# Altium project AEON.Feeder.ApplicationBoard.PrjPcb
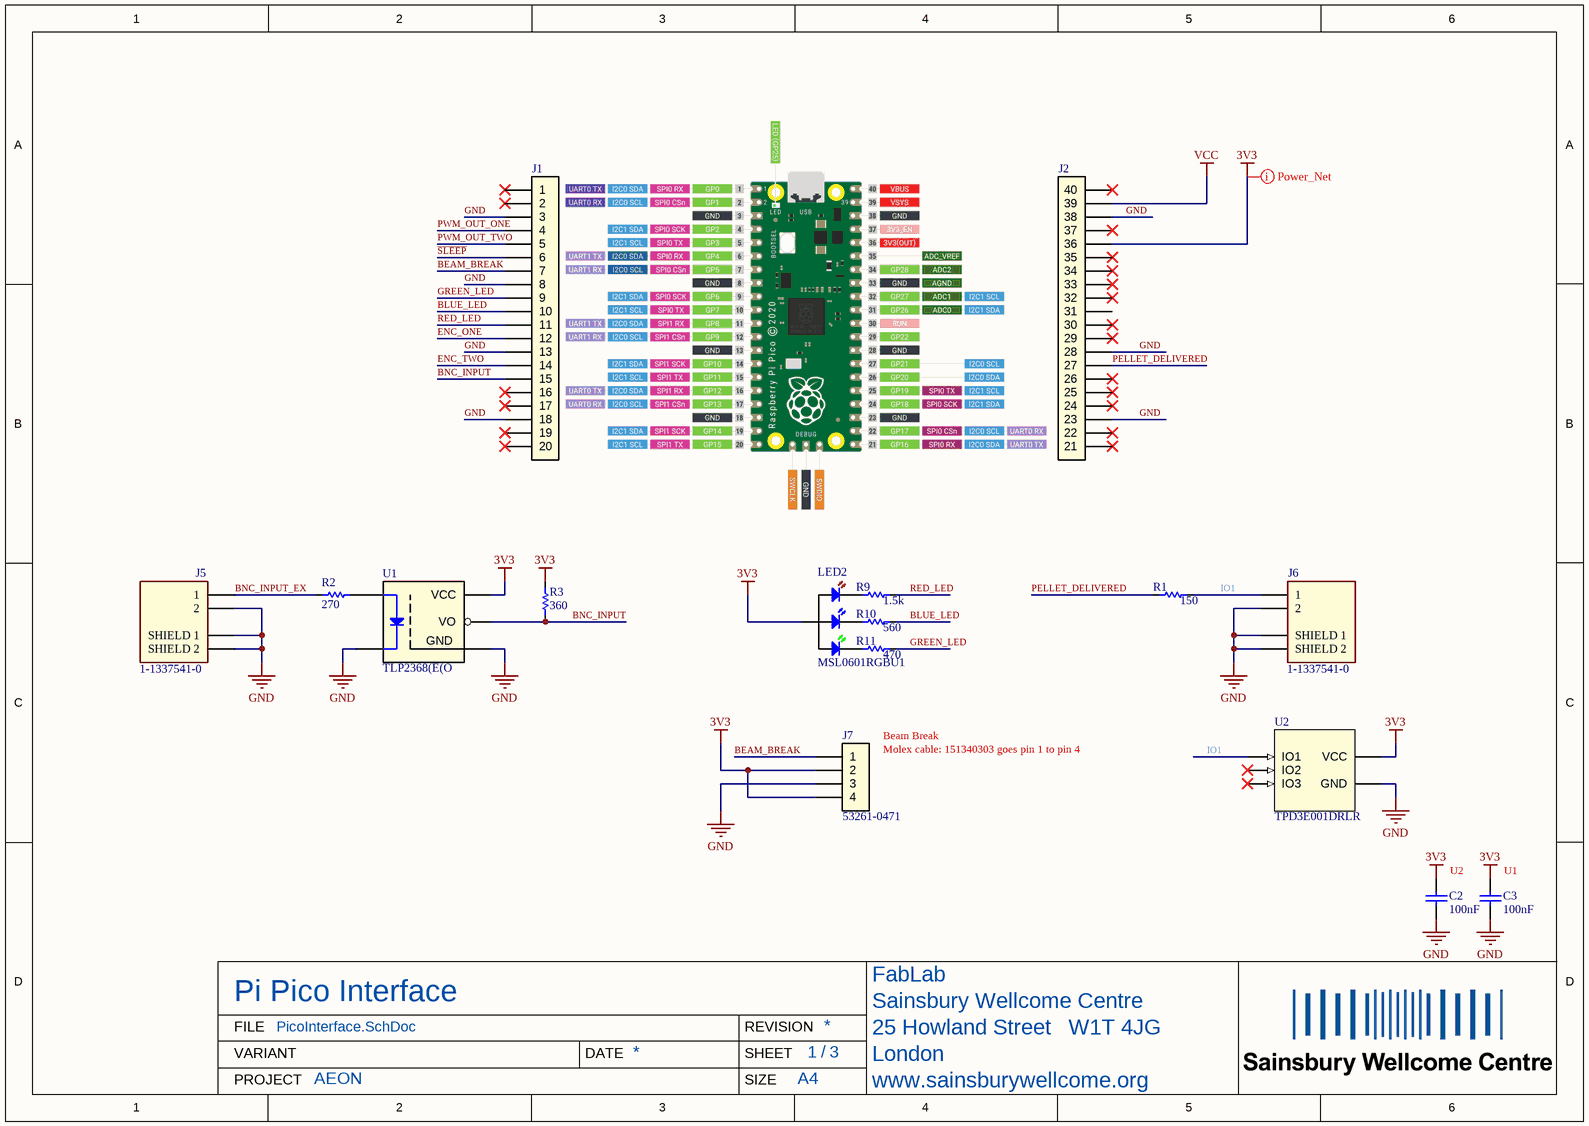
[diagram p0: PicoInterface.SchDoc]
Project: AEON
3 sheets, 33 parts. Net scope: global (net labels, ports and power ports of the same name join across sheets).
Board file: AEON.Feeder.ApplicationBoard.PcbDoc
Sheets:
  PicoInterface.SchDoc
  PowerSupply.SchDoc
  MotorDriver.Mikroe.SchDoc

## Sheet PicoInterface.SchDoc
size 297 x 209 mm; SheetNumber: 1; SheetTotal: 3; swcgroup: FabLab; Org: Sainsbury Wellcome Centre; Add1: 25 Howland Street; Add2: London; Add3: W1T 4JG; WebAddress: www.sainsburywellcome.org; SheetSize: A4; SheetName: Pi Pico Interface

### Parts
C2  value 100nF  [FP-GRM188-0_1-e0_2_0_5-IPC_B]  (hidden comment: C0603-100nF-100V-10%-X7R)
C3  value 100nF  [FP-GRM188-0_1-e0_2_0_5-IPC_B]  (hidden comment: C0603-100nF-100V-10%-X7R)
J1  SSW-120-01-x-S  [SAMTEC_SSW-120-01-G-S]  (value not drawn)
J2  SSW-120-01-x-S - 21-40  [SAMTEC_SSW-120-01-G-S - 21-40]  (value not drawn)
J5  1-1337541-0  [TE- 1-1337541-0]
J6  1-1337541-0  [TE- 1-1337541-0]
J7  53261-0471  [MOLEX_53261-0471]
LED2  MSL0601RGBU1  [LED_MSL06_ROM]
R1  value 150  [FP-CPF0603-IPC_B]  (hidden comment: R0603-150R-1/16W-0.1%)
R2  value 270  [FP-CPF0603-IPC_B]  (hidden comment: R0603-270R-1/16W-0.1%)
R3  value 360  [FP-CPF0603-IPC_B]  (hidden comment: R0603-360R-1/16W-0.1%)
R9  value 1.5k  [FP-CPF0603-IPC_B]  (hidden comment: R0603-1k5-1/16W-0.1%)
R10  value 560  [FP-CPF0603-IPC_B]  (hidden comment: R0603-560R-1/16W-0.1%)
R11  value 470  [FP-CPF0603-IPC_B]  (hidden comment: R0603-470R-1/16W-0.1%)
U1  PartNumber: TLP2368(E(O  [5pin SO6_TOS]  (hidden comment: TLP2368)
U2  TPD3E001DRLR  [DRL5_TEX]

### Nets
3V3: C2.2 C3.2 J2.36 J7.2 J7.4 LED2.1 R3.2 U1.6(VCC) U2.5(VCC)
GND: C2.1 C3.1 J1.3 J1.8 J1.13 J1.18 J2.23 J2.28 J2.38 J5.2 J5.SH1(SHIELD_1) J5.SH2(SHIELD_2) J6.2 J6.SH1(SHIELD_1) J6.SH2(SHIELD_2) J7.3 U1.3(CATHODE) U1.4(GND) U2.3(GND)
VCC: J2.39
~{SLEEP}: J1.6
BEAM_BREAK: J1.7 J7.1
BLUE_LED: J1.10 R10.2
BNC_INPUT: J1.15 R3.1 U1.5(VO)
BNC_INPUT_EX: J5.1 R2.1
ENC_ONE: J1.12
ENC_TWO: J1.14
GREEN_LED: J1.9 R11.2
IO1: J6.1 R1.2 U2.1(IO1)
PELLET_DELIVERED: J2.27 R1.1
PWM_OUT_ONE: J1.4
PWM_OUT_TWO: J1.5
RED_LED: J1.11 R9.2
NetLED2_2: LED2.2 R11.1
NetLED2_3: LED2.3 R10.1
NetLED2_4: LED2.4 R9.1
NetR2_2: R2.2 U1.1(ANODE)

Not connected (* = marked no-connect by the designer): J1 1* 2* 16* 17* 19* 20*; J2 21* 22* 24* 25* 26* 29* 30* 31 32* 33* 34* 35* 37* 40*; U2 2(IO2)* 4(IO3)*

### Layout directives
net class Power Nets: 3V3

### Notes on the sheet
- (near J7) Beam Break
- (near J7) Molex cable: 151340303 goes pin 1 to pin 4
- U2
- (near C3) U1
- FILE
- VARIANT
- DATE
- REVISION
- SHEET
- /
- PROJECT
- SIZE

### Library data of the parts
C2 C3 = CMP-611-0027-15: 0.1µF ±10% 100V Ceramic Capacitor X7R 0603 (1608 Metric); Pick&PlaceFootprint: 0603_CAP; Dielectric: X7R; REACH SVHC: No SVHC; Case Code (Metric): 1608; Series: GRM; Case/Package: 0603; Capacitance: 100nF; RoHS Compliant: Yes; Radiation Hardening: No; Case Code (Imperial): 0603; Min Operating Temperature: -55°C; Capacitor Type: Ceramic; Voltage Rating: 100V; Construction: Flat; Lead Free: Lead Free; Size: 0.8mm; Packaging: Tape and Reel; Voltage Rating (DC): 100V; Voltage: 100V; Width: 0.8mm; Max Operating Temperature: 125°C; RoHS: Yes; Material: Ceramic; Depth: 0.8mm; Thickness: 0.035inch; Termination: SMD/SMT; Weight: 0.000222oz; Length: 1.6mm; Mount: Surface Mount; Height: 0.8mm; Package Quantity: 1; Tolerance: 10%
J1 = CMP-310-0034-2: Conn Socket Strip SKT 20 POS 2.54mm Solder ST Thru-Hole; Gender: Female; Number of Contacts: 20; Mating Cycles: 100; Number of Rows: 1; Color: Black; RoHS Compliant: Yes; Contact Plating: Gold; Pitch: 2.54mm; Termination: Solder; Contact Material: Bronze; Mount: Through Hole
J2 = CMP-310-0035-1: Conn Socket Strip SKT 20 POS 2.54mm Solder ST Thru-Hole (pins 21 - 40); Gender: Female; Mating Cycles: 100; Number of Contacts: 20; Contact Material: Bronze; RoHS Compliant: Yes; Number of Rows: 1; Contact Plating: Gold; Mount: Through Hole; Pitch: 2.54mm; Termination: Solder; Color: Black
J5 J6 = CMP-730-0000-5: TE CONNECTIVITY / GREENPAR         1-1337541-0            RF / Coaxial Connector, BNC Coaxial, Straight Jack, Solder, 50 ohm, Brass; PCB Mounting Orientation: Vertical; Body Plating: Nickel; Number of Positions: 1; Connector Type: BNC, Jack; Sealable: No (Without); Polarity: Normal; PCB Mount Retention: With; Insulation Resistance: 5GR; Max Frequency: 4GHz; Tail Length: 5.8mm; Gender: Female; PCB Thickness: 0.126inch; Body Material: Zinc; Dielectric Material: PE; Impedance: 50R; Max Operating Temperature: 85°C; Length: 14.76mm; Min Operating Temperature: -55°C; Radiation Hardening: No; Insulation Material: Polybutylene; Mount: Panel; Fastening Type: Bayonet; Packaging: Box; Housing Material: Polyester; Housing Colour: White; Contact Material: Brass; Frequency: 4GHz; ELV: Compliant; Colour: White; Plating: Nickel; PartNumber: 1-1337541-0; Contact Plating: Gold; REACH SVHC: Unknown; Termination: Solder; Orientation: Straight; Package Quantity: 100; Depth: 15.8mm
J7 = CMP-370-0017-6: MOLEX 1.25mm (.049") Pitch PicoBlade Header, Surface Mount, Right Angle, Lead-free, 4 Circuits; Gender: Male; Voltage Rating: 125V; Number of Positions: 4; Contact Resistance: 20mR; Insulation Resistance: 100MR; Current Rating: 1A; Glow Wire Compliant: Non-compliant; Orientation: Right Angle; Package Quantity: 1000; Color: Beige; Voltage Rating (DC): 125V; Series: 53261; Lead Free: Lead Free; Contact Plating: Tin; Housing Color: Natural; Contact Gender: Male; Contact Material: Tin; Number of Rows: 1; Mount: Surface Mount; Housing Material: Thermoplastic; Lead Pitch: 1.25mm; Working Voltage: 125V; Flammability Rating: UL94 V-0; Packaging: Cut Tape; Termination: SMD/SMT; Pitch: 1.25mm; Radiation Hardening: No; Min Operating Temperature: -40°C; Case/Package: 53261-0471; Voltage Rating (AC): 125V; Number of Circuits: 4; Contact Type: -; Max Operating Temperature: 105°C; Number of Contacts: 4; REACH SVHC: Unknown; Weight: 0.005598oz
LED2 = CMP-520-0010-2: Triple Color LED, Red/green/blue, Milky White; Pick&PlaceFootprint: MSL06; Mount: Surface Mount; PartNumber: MSL0601RGBU1
R1 = CMP-633-0078-2: Surface Mount Resistor 150 Ohm 1/16 W 0.1% 0603 (1608 Metric); Number of Resistors: 1; Pick&PlaceFootprint: R0603; Temperature Coefficient: 25ppm/°C; Power Rating: 62.5mW; Voltage Rating: 50V; Max Power Dissipation: 62.5 mW; Max Operating Temperature: 155°C; Series: CPF; RoHS: Yes; Case Code (Metric): 1608; Width: 0.8mm; Construction: Chip; Length: 1.6mm; Composition: Thin Film; Min Operating Temperature: -55°C; REACH SVHC: Yes; RoHS Compliant: Yes; Height: 0.45mm; Termination: Wraparound; Packaging: Tape and Reel; Resistance: 150; Size Code: 0603; Technology: THIN FILM; ELV: Compliant; Weight: 7.1E-05oz; Tolerance: 0.1%; Number of Pins: 2; Resistance Tolerance: 0.1%; Resistor Type: FIXED RESISTOR; Mount: Surface Mount; Number of Terminations: 2; Case Code (Imperial): 0603; Voltage Rating (DC): 50V; Case/Package: 0603
R2 = CMP-633-0083-1: Surface Mount Resistor 270 Ohm 1/16 W 0.1% 0603 (1608 Metric); Voltage Rating: 50V; Number of Resistors: 1; Max Power Dissipation: 62.5 mW; Pick&PlaceFootprint: R0603; Power Rating: 62.5mW; Temperature Coefficient: 25ppm/°C; Voltage Rating (DC): 50V; Weight: 7.1E-05oz; RoHS: Yes; REACH SVHC: Yes; Size Code: 0603; Mount: Surface Mount; Tolerance: 0.1%; Composition: Thin Film; Length: 1.6mm; Number of Pins: 2; Min Operating Temperature: -55°C; Width: 0.8mm; Technology: THIN FILM; Max Operating Temperature: 155°C; Resistor Type: FIXED RESISTOR; Number of Terminations: 2; Case Code (Imperial): 0603; Packaging: Tape and Reel; Construction: Chip; Case Code (Metric): 1608; Case/Package: 0603; Series: CPF; RoHS Compliant: Yes; Termination: Wraparound; Resistance: 270; ELV: Compliant; Height: 0.45mm; Resistance Tolerance: 0.1%
R3 = CMP-633-0019-16: Surface Mount Resistor 360 Ohm 1/16 W 0.1% 0603 (1608 Metric); Pick&PlaceFootprint: R0603; Voltage Rating: 50V; Number of Resistors: 1; Temperature Coefficient: 25ppm/°C; Power Rating: 62.5mW; Max Power Dissipation: 62.5 mW; REACH SVHC: No SVHC; Tolerance: 0.1%; Case Code (Metric): 1608; Weight: 7.1E-05oz; Resistance Tolerance: 0.1%; Resistor Type: Thin Film; Series: CPF; RoHS: Yes; Case/Package: 0603; Voltage Rating (DC): 50V; Length: 1.6mm; Max Operating Temperature: 155°C; Technology: Thin Film; Min Operating Temperature: -55°C; Packaging: Tape and Reel; Size Code: 0603; ELV: Compliant; Number of Terminations: 2; Resistance: 360; Height: 0.45mm; Case Code (Imperial): 0603; Number of Pins: 2; Composition: Thin Film; Mount: Surface Mount; RoHS Compliant: Yes; Termination: Solder; Width: 0.8mm
R9 = CMP-633-0029-14: Surface Mount Resistor 1k5 Ohm 1/16 W 0.1% 0603 (1608 Metric); Number of Resistors: 1; Power Rating: 62.5mW; Max Power Dissipation: 62.5 mW; Voltage Rating: 50V; Pick&PlaceFootprint: R0603; Temperature Coefficient: 25ppm/°C; Length: 1.6mm; Resistance: 1.5k; Case Code (Metric): 1608; Max Operating Temperature: 155°C; Technology: Thin Film; Height: 0.45mm; Resistor Type: Thin Film; Case Code (Imperial): 0603; Case/Package: 0603; Number of Terminations: 2; Min Operating Temperature: -55°C; REACH SVHC: No SVHC; Width: 0.8mm; RoHS Compliant: Yes; ELV: Compliant; Size Code: 0603; RoHS: Yes; Packaging: Tape and Reel; Tolerance: 0.1%; Mount: Surface Mount; Composition: Thin Film; Voltage Rating (DC): 50V; Weight: 7.1E-05oz; Termination: Solder; Number of Pins: 2; Resistance Tolerance: 0.1%; Series: CPF
R10 = CMP-633-0030-9: Surface Mount Resistor 560 Ohm 1/16 W 0.1% 0603 (1608 Metric); Number of Resistors: 1; Voltage Rating (DC): 50V; Temperature Coefficient: 25ppm/°C; Pick&PlaceFootprint: R0603; Power Rating: 62.5mW; Max Power Dissipation: 62.5 mW; ELV: Compliant; Technology: Thin Film; Resistor Type: Thin Film; Series: CPF; Number of Terminations: 2; Case Code (Metric): 1608; Resistance: 560; Case/Package: 0603; Width: 0.8mm; Max Operating Temperature: 155°C; Length: 1.6mm; RoHS Compliant: Yes; Termination: Solder; Voltage Rating: 50V; Min Operating Temperature: -55°C; Height: 0.45mm; Weight: 7.1E-05oz; Case Code (Imperial): 0603; Size Code: 0603; Mount: Surface Mount; REACH SVHC: No SVHC; RoHS: Yes; Composition: Thin Film; Packaging: Tape and Reel; Tolerance: 0.1%; Number of Pins: 2; Resistance Tolerance: 0.1%
R11 = CMP-633-0020-13: Surface Mount Resistor 470 Ohm 1/16 W 0.1% 0603 (1608 Metric); Power Rating: 62.5mW; Max Power Dissipation: 62.5 mW; Pick&PlaceFootprint: R0603; Temperature Coefficient: 25ppm/°C; Voltage Rating: 50V; Number of Resistors: 1; ELV: Compliant; Series: CPF; Mount: Surface Mount; Weight: 7.1E-05oz; Resistance Tolerance: 0.1%; Width: 0.8mm; REACH SVHC: No SVHC; Length: 1.6mm; Termination: Solder; Number of Pins: 2; Size Code: 0603; Case Code (Imperial): 0603; RoHS Compliant: Yes; Max Operating Temperature: 155°C; Packaging: Tape and Reel; Tolerance: 0.1%; Resistance: 470; Min Operating Temperature: -55°C; Resistor Type: Thin Film; Case Code (Metric): 1608; Number of Terminations: 2; Technology: Thin Film; Case/Package: 0603; Composition: Thin Film; Voltage Rating (DC): 50V; Height: 0.45mm; RoHS: Yes
U1 = CMP-530-0000-11: TOSHIBA         TLP2368(E(O             Digital Output Optocoupler, Open Collector, 1 Channel, SOIC, 5 Pins, 3.75 kV, 20 Mbaud; Forward Voltage: 1.7V; Reverse Breakdown Voltage: 5V; Output Current: 25mA; Direction: Unidirectional; Power Dissipation: 60mW; Pick&PlaceFootprint: SO6; Propagation Delay: 60ns; Number of Elements: 1; Input Current: 14mA; Isolation Voltage: 3.75kV; Packaging: Tape and Reel; Min Operating Temperature: -40°C; Mount: Surface Mount; Case/Package: SO; Max Operating Temperature: 125°C; Radiation Hardening: No; Forward Current: 25mA; Number of Channels: 1; Number of Pins: 5; REACH SVHC: No SVHC
U2 = CMP-820-0000-4: Low-Capacitance 3-Channel +/-15KV ESD-Protection Array for High-Speed Data Interfaces 5-SOT-5X3; Pick&PlaceFootprint: DRL-5; Mount: Surface Mount; PartNumber: TPD3E001DRLR

## Sheet PowerSupply.SchDoc
size 297 x 209 mm; SheetNumber: 2; SheetTotal: 3; swcgroup: FabLab; Org: Sainsbury Wellcome Centre; Add1: 25 Howland Street; Add2: London; Add3: W1T 4JG; WebAddress: www.sainsburywellcome.org; SheetSize: A4; SheetName: Power Supply
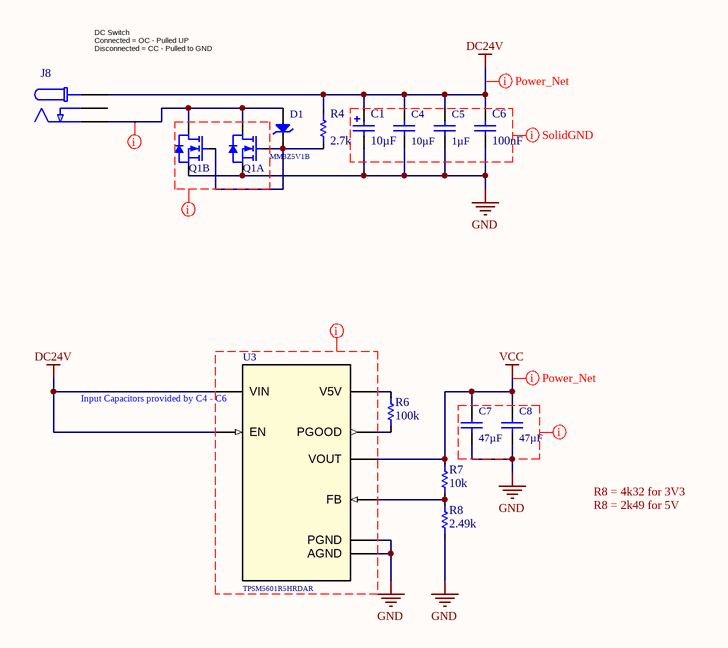
[diagram p1: PowerSupply.SchDoc]

### Parts
C1  value 10µF  [CAP_EEEFK1H100P]  (hidden comment: CPOLD-10uF-50V-20%-Alu)
C4  value 10µF  [CAPC3225X279X50NL20T25]  (hidden comment: C1210-10uF-50V-10%-X7R)
C5  value 1µF  [CAPC0805(2012)130_N]  (hidden comment: C0805-1uF-50V-10%-X7R)
C6  value 100nF  [FP-GRM188-0_1-e0_2_0_5-IPC_B]  (hidden comment: C0603-100nF-100V-10%-X7R)
C7  value 47µF  [FP-GRM32E-0_3-0_2-IPC_B]  (hidden comment: C1210-47uF-10V-10%-X7R)
C8  value 47µF  [FP-GRM32E-0_3-0_2-IPC_B]  (hidden comment: C1210-47uF-10V-10%-X7R)
D1  PartNumber: MM3Z5V1B  [SODFL250X100-2N]  (hidden comment: MM3Z10VB)
J8  694108105102  [WE_694108105102]  (value not drawn)
Q1  FDMC8030  [TRANS_FDMC8030]  (value not drawn)  (parts A,B of 2)
R4  value 2.7k  [FP-CPF0603-IPC_B]  (hidden comment: R0603-2k7-1/16W-0.1%)
R6  value 100k  [FP-CPF0603-IPC_B]  (hidden comment: R0603-100k-1/16W-0.1%)
R7  value 10k  [FP-CPF0603-IPC_B]  (hidden comment: R0603-10k-1/16W-0.1%)
R8  value 2.49k  [FP-CPF0603-IPC_B]  (hidden comment: R0603-2k49-1/16W-0.1%)
U3  TPSM5601R5HRDAR  [IC_TPSM5601R5HRDAR]

### Nets
DC24V: C1.1 C4.2 C5.2 C6.2 J8.1 R4.2 U3.1(VIN) U3.2(EN)
GND: C1.2 C4.1 C5.1 C6.1 C7.1 C8.1 Q1.4(S1) Q1.5(S2) R8.1 U3.10(AGND) U3.15(PGND)
VCC: C7.2 C8.2 R7.2 U3.7(VOUT)
NetD1_1: D1.1(A) J8.2 Q1.9(D2) Q1.10(D1)
NetD1_2: D1.2(C) Q1.1(G1) Q1.8(G2) R4.1
NetR6_1: R6.1 U3.12(PGOOD)
NetR6_2: R6.2 U3.11(V5V)
NetR7_1: R7.1 R8.2 U3.9(FB)

Not connected (* = marked no-connect by the designer): J8 3

### Layout directives
net class Power Nets: DC24V, NetD1_1, VCC
CompClassName: SolidGND: (no net found under the mark)

### Notes on the sheet
- (near J8) DC Switch
  Connected = OC - Pulled UP
  Disconnected = CC - Pulled to GND
- (near U3) Input Capacitors provided by C4 - C6
- R8 = 4k32 for 3V3
- R8 = 2k49 for 5V
- FILE
- VARIANT
- DATE
- REVISION
- SHEET
- /
- PROJECT
- SIZE

### Library data of the parts
C1 = CMP-612-0001-7: 10µF ±20% 50V SMD Aluminum Electrolytic Capacitor Surface Mount D; Lead Diameter: 0.65mm; Polarity: Polar; Ripple Current: 165mA; Capacitance: 10uF; Life (Hours): 2000Hour; Impedance: 880mR; Leakage Current: 3uA; Pick&PlaceFootprint: CPOLD; Max Operating Temperature: 105°C; Voltage Rating: 50V; Voltage: 50V; Contact Plating: Tin; Termination: SMD/SMT; Size: 5.8mm; Package Quantity: 1000; Ripple Current (AC): 165mA; Height: 5.8mm; Height - Seated (Max): 0.24inch; Lead Pitch: 1.8mm; Packaging: Tape and Reel; Radiation Hardening: No; Case/Package: CPOLD; Width: 7.8mm; Mount: Surface Mount,PCB; Length: 5.8mm; Construction: Cylindrical; Series: FK; Voltage Rating (DC): 50V; Lead Free: Lead Free; Min Operating Temperature: -55°C; ESR (Equivalent Series Resistance): 880mR; Diameter: 6.3mm; Number of Pins: 2; RoHS Compliant: Yes; REACH SVHC: No SVHC; Tolerance: 20%; RoHS: Yes; Capacitor Type: Electrolytic
C4 = CMP-611-0024-5: 10uF ±10% 50V Ceramic Capacitor X7R 1210 (3225 Metric); Pick&PlaceFootprint: C1210; Capacitance: 10uF; Capacitor Type: Ceramic; Voltage Rating: 50V; Dielectric: X7R; Tolerance: 10%; Case/Package: 1210; RoHS: Yes; Mount: Surface Mount
C5 = CMP-611-0023-3: 1uF ±10% 50V Ceramic Capacitor X7R 0805 (2012 Metric); Pick&PlaceFootprint: C0805; Capacitance: 1uF; Case Code (Imperial): 0805; Mount: SMD; Case/Package: 0805; RoHS: Yes; Case Code (Metric): 2012; Tolerance: 10%; Capacitor Type: Ceramic; Voltage Rating: 50V
C6 = CMP-611-0027-15: as C2 on sheet PicoInterface; Mount: Surface Mount; Voltage Rating: 100V; Min Operating Temperature: -55°C; Termination: SMD/SMT; Width: 0.8mm; Series: GRM; Packaging: Tape and Reel; Size: 0.8mm; Case Code (Metric): 1608; REACH SVHC: No SVHC; Case/Package: 0603; Construction: Flat; Dielectric: X7R; Weight: 0.000222oz; Height: 0.8mm; Tolerance: 10%; Package Quantity: 1; Lead Free: Lead Free; Voltage: 100V; RoHS Compliant: Yes; Capacitance: 100nF; Thickness: 0.035inch; Radiation Hardening: No; Depth: 0.8mm; Length: 1.6mm; Max Operating Temperature: 125°C; Material: Ceramic; Case Code (Imperial): 0603; Voltage Rating (DC): 100V; Capacitor Type: Ceramic; RoHS: Yes
C7 C8 = CMP-611-0031-10: 47uF ±10% 10V Ceramic Capacitor X7R 1210 (3225 Metric); Pick&PlaceFootprint: C1210; RoHS Compliant: Yes; Series: GRM; Termination: SMD/SMT; Number of Pins: 2; Package Quantity: 1; Case Code (Imperial): 1210; Mount: Surface Mount; Construction: Flat; Tolerance: 10%; Capacitance: 47uF; Depth: 2.5mm; Dielectric: X7R; Packaging: Tape and Reel; Lead Free: Lead Free; Voltage Rating: 10V; Height: 2.5mm; Case Code (Metric): 3225; Max Operating Temperature: 125°C; Thickness: 0.106inch; Case/Package: 1210; Radiation Hardening: No; Material: Ceramic; Min Operating Temperature: -55°C; Voltage Rating (DC): 10V; Voltage: 10V; Length: 3.2mm; Width: 2.5mm; REACH SVHC: No SVHC; Capacitor Type: Ceramic; RoHS: Yes
D1 = CMP-822-0001-1: DIODE ZENER 10V 200MW SOD323F; Peak Reverse Current: 1.8uA; ESD Protection: No; Element Configuration: Single; Impedance: 18R; Voltage Tolerance: 2%; Max Reverse Leakage Current: 180nA; Forward Voltage: 1V; Test Current: 5mA; Radiation Hardening: No; Packaging: Tape and Reel; Weight: 0.0276g; Max Power Dissipation: 200mW; Max Reverse Current: 180nA; Zener Voltage: 10V; Min Operating Temperature: -65°C; Mount: Surface Mount; Length: 1.3mm; Working Voltage: 10V; Tolerance: 2%; Lead Free: Lead Free; Width: 1.7mm; Max Operating Temperature: 150°C; Package Quantity: 1; Power Dissipation: 200mW; RoHS Compliant: Yes; REACH SVHC: No SVHC; Contact Plating: Tin, Matte; Number of Pins: 2; Height: 1mm
J8 = CMP-360-0003-3: DC Power Connectors WR-DC PwrJk CtrPnSMT Right Angled W/Peg; Shielding: Unshielded; Voltage Rating (DC): 24V; Insulation Resistance: 100MR; Gender: Male; Current Rating: 5A; Connector Type: Jack,Power; Max Operating Temperature: 85°C; REACH SVHC: Unknown; Housing Material: Polyamide; Packaging: Tape and Reel; Flammability Rating: UL94 V-0; Termination: SMD/SMT; Mount: Surface Mount; Package Quantity: 200; Contact Material: Copper Alloy; Min Operating Temperature: -40°C; Color: Black; Voltage Rating: 24V; Contact Plating: Tin; Contact Gender: Female
Q1 = CMP-830-0003-2: ON SEMICONDUCTOR - FDMC8030 - Dual MOSFET, Dual N Channel, 12 A, 40 V, 0.008 ohm, 10 V, 1.5 V; FET Type: 2 N-Channel; Drain to Source Resistance: 10mR; Max Power Dissipation: 800mW; Gate to Source Voltage (Vgs): 12V; Turn-Off Delay Time: 19ns; Input Capacitance: 1.975nF; Turn-On Delay Time: 7ns; Continuous Drain Current (ID): 12A; Polarity: N-CHANNEL; Fall Time: 3ns; Drain to Source Voltage (Vdss): 40V; Number of Elements: 1; Radiation Hardening: No; Length: 3mm; Min Operating Temperature: -55°C; RoHS Compliant: Yes; Mount: Surface Mount; Packaging: Tape and Reel; Element Configuration: Dual; Package Quantity: 3000; Number of Pins: 8; Weight: 0.196g; Max Operating Temperature: 150°C; Power Dissipation: 800mW; Rds On Max: 10mR; Width: 3mm; Series: PowerTrench®; Drain to Source Breakdown Voltage: 40V; Height: 0.75mm; Rise Time: 3ns
R4 = CMP-633-0031-14: Surface Mount Resistor 2k7 Ohm 1/16 W 0.1% 0603 (1608 Metric); Pick&PlaceFootprint: R0603; Voltage Rating: 50V; Power Rating: 62.5mW; Temperature Coefficient: 25ppm/°C; Number of Resistors: 1; Max Power Dissipation: 62.5 mW; Tolerance: 0.1%; Case/Package: 0603; RoHS: Yes; Resistance: 2.7k; Mount: Surface Mount; Resistance Tolerance: 0.1%; Resistor Type: Thin Film; REACH SVHC: No SVHC; Size Code: 0603; Case Code (Metric): 1608; Number of Terminations: 2; RoHS Compliant: Yes; Weight: 7.1E-05oz; Termination: Solder; Length: 1.6mm; Composition: Thin Film; Min Operating Temperature: -55°C; ELV: Compliant; Packaging: Tape and Reel; Max Operating Temperature: 155°C; Case Code (Imperial): 0603; Width: 0.8mm; Technology: Thin Film; Number of Pins: 2; Voltage Rating (DC): 50V; Height: 0.45mm; Series: CPF
R6 = CMP-633-0000-17: Surface Mount Resistor 100k Ohm 1/16 W 0.1% 0603 (1608 Metric); Number of Resistors: 1; Temperature Coefficient: 25ppm/°C; Voltage Rating (DC): 50V; Power Rating: 62.5mW; Pick&PlaceFootprint: R0603; Max Power Dissipation: 62.5 mW; Termination: Solder; Case Code (Metric): 1608; Min Operating Temperature: -55°C; Case Code (Imperial): 0603; ELV: Compliant; Height: 0.45mm; Packaging: Tape and Reel; Weight: 7.1E-05oz; Number of Pins: 2; Tolerance: 0.1%; Max Operating Temperature: 155°C; Resistance: 100k; Width: 0.8mm; Number of Terminations: 2; Composition: Thin Film; Mount: Surface Mount; Length: 1.6mm; Voltage Rating: 50V; REACH SVHC: No SVHC; Case/Package: 0603; RoHS: Yes; Technology: Thin Film; RoHS Compliant: Yes; Resistance Tolerance: 0.1%; Resistor Type: Thin Film; Size Code: 0603; Series: CPF
R7 = CMP-633-0002-15: Surface Mount Resistor 10k Ohm 1/16 W 0.1% 0603 (1608 Metric); Pick&PlaceFootprint: R0603; Power Rating: 62.5mW; Voltage Rating (DC): 50V; Number of Resistors: 1; Temperature Coefficient: 25ppm/°C; Max Power Dissipation: 62.5 mW; Height: 0.45mm; Case Code (Imperial): 0603; RoHS: Yes; Composition: Thin Film; Number of Terminations: 2; Case/Package: 0603; Min Operating Temperature: -55°C; ELV: Compliant; Mount: Surface Mount; Packaging: Tape and Reel; Max Operating Temperature: 155°C; Tolerance: 0.1%; Case Code (Metric): 1608; Resistance: 10k; REACH SVHC: No SVHC; Width: 0.8mm; Number of Pins: 2; Voltage Rating: 50V; Length: 1.6mm; Termination: Solder; Weight: 7.1E-05oz; RoHS Compliant: Yes; Size Code: 0603; Series: CPF; Resistance Tolerance: 0.1%; Technology: Thin Film; Resistor Type: Thin Film
R8 = CMP-633-0082-1: Surface Mount Resistor 2.49k Ohm 1/16 W 0.1% 0603 (1608 Metric); Voltage Rating: 50V; Number of Resistors: 1; Pick&PlaceFootprint: R0603; Max Power Dissipation: 62.5 mW; Temperature Coefficient: 25ppm/°C; Power Rating: 62.5mW; Length: 1.6mm; Min Operating Temperature: -55°C; Resistance Tolerance: 0.1%; Number of Terminations: 2; Technology: THIN FILM; REACH SVHC: Yes; Case/Package: 0603; RoHS: Yes; Mount: Surface Mount; Weight: 7.1E-05oz; RoHS Compliant: Yes; Composition: Thin Film; Voltage Rating (DC): 50V; Case Code (Metric): 1608; Construction: Chip; Max Operating Temperature: 155°C; Tolerance: 0.1%; Resistor Type: FIXED RESISTOR; Width: 0.8mm; ELV: Compliant; Series: CPF; Packaging: Tape and Reel; Number of Pins: 2; Resistance: 2.49k; Size Code: 0603; Termination: Wraparound; Height: 0.45mm; Case Code (Imperial): 0603
U3 = CMP-A10-0005-5: 60-V input, 1-V to 16-V output, 1.5-A power module in enhanced HotRod™ QFN package 15-B3QFN -40 to 125; pin to pad: 1>1+14 7>7+8 15>15+16+17+18+19+20+21+22+23+24+25+26; Pick&PlaceFootprint: B3QFN; PartNumber: TPSM5601R5HRDAR

## Sheet MotorDriver.Mikroe.SchDoc
size 297 x 209 mm; Revision: 1; SheetNumber: 3; SheetTotal: 3; swcgroup: FabLab; Org: Sainsbury Wellcome Centre; Add1: 25 Howland Street; Add2: London; Add3: W1T 4JG; WebAddress: www.sainsburywellcome.org; SheetSize: A4; SheetName: Mikroe Motor Click 5 interface
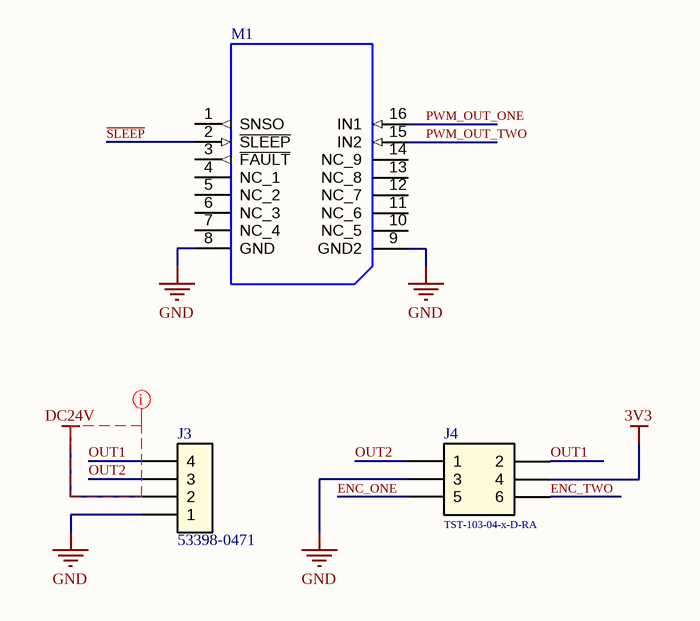
[diagram p2: MotorDriver.Mikroe.SchDoc]

### Parts
J3  53398-0471  [FP-533980471-MFG]
J4  TST-103-04-x-D-RA  [SAMTEC_TST-103-04-G-D-RA]
M1  MIKROE-2699  [MIKROE-M]  (value not drawn)

### Nets
3V3: J4.4
DC24V: J3.2
GND: J3.1 J4.3 M1.8(GND) M1.9(GND2)
~{SLEEP}: M1.2(~{SLEEP})
ENC_ONE: J4.5
ENC_TWO: J4.6
OUT1: J3.4 J4.2
OUT2: J3.3 J4.1
PWM_OUT_ONE: M1.16(IN1)
PWM_OUT_TWO: M1.15(IN2)

Not connected (* = marked no-connect by the designer): M1 1(SNSO) 3(~{FAULT}) 4(NC_1) 5(NC_2) 6(NC_3) 7(NC_4) 10(NC_5) 11(NC_6) 12(NC_7) 13(NC_8) 14(NC_9)

### Layout directives
net class Power Nets: DC24V, OUT1, OUT2

### Notes on the sheet
- FILE
- VARIANT
- DATE
- REVISION
- SHEET
- /
- PROJECT
- SIZE

### Library data of the parts
J3 = CMP-370-0030-2: Board Connector, 4 Contact(s), 1 Row(s), Male, Straight, 0.049 inch Pitch, Surface Mount Terminal, Locking, Natural Insulator, Receptacle; Polarization Key: POLARIZED HOUSING; Number of Contacts: 4; DIN Conformance: No; Reference Standard: UL; Plating Thickness: 39uin; Mating Information: MULTIPLE MATING PARTS AVAILABLE; Durability: 30Cycles; Body Length: 0.383inch; Contact Pattern: RECTANGULAR; Option: General Purpose; Reliability: COMMERCIAL; Number of Rows Loaded: 1; Dielectric Withstanding Voltage (AC): 250V; Board Mounting Option: FITTING NAIL; Body Breadth: 0.146inch; Contact Resistance: 20mR; Insulation Resistance: 100MR; Rated Current (Signal): 1A; Body Depth: 0.185inch; Contact Style: Blade Pin; Contact Finish - Termination: Matte Tin (Sn) - with Nickel (Ni) barrier; Contact Material: Bronze; Mount: Board; Max Operating Temperature: 85°C; Contact Gender: Male; Connector Type: BOARD CONNECTOR; Termination: SMD/SMT; Mounting Style: STRAIGHT; Insulation Material: Polyamide; Min Operating Temperature: -40°C; IEC Conformance: No; Contact Finish - Mating: MATTE TIN (39) OVER NICKEL; PartNumber: 53398-0471; Filter Feature: No; Body/Shell Style: RECEPTACLE; RoHS Compliant: Yes; MIL Conformance: No; JESD-609 Code: e3; Number Of PCB Rows: 1; Mating Contact Pitch: 0.049inch; Flammability Rating: UL94 V-0; PCB Contact Pattern: RECTANGULAR; Insulation Color: Natural; Number Of Connectors: 1; Mounting Option 1: LOCKING; Mixed Contacts: No; Terminal Pitch: 1.25mm; REACH SVHC: Yes
J4 = CMP-370-0023-6: Board Connector, 6 Contact(s), 2 Row(s), Male, Right Angle, Solder Terminal; PartNumber: TST-103-04-G-D-RA; Number of Contacts: 6; Pitch: 2.54; Mount: Through Hole; Number of Rows: 2
M1 = CMP-A10-0003-3: DRV8701 Brushed DC Motor Full-Bridge Gate DC Motor Driver 5 Click Add-On Board

## Nets that join several sheets
3V3: PicoInterface (9 pins), MotorDriver.Mikroe (J4.4)
DC24V: PowerSupply (8 pins), MotorDriver.Mikroe (J3.2)
GND: PicoInterface (19 pins), PowerSupply (11 pins), MotorDriver.Mikroe (J3.1 J4.3 M1.8 M1.9)
VCC: PicoInterface (J2.39), PowerSupply (C7.2 C8.2 R7.2 U3.7)
~{SLEEP}: PicoInterface (J1.6), MotorDriver.Mikroe (M1.2)
ENC_ONE: PicoInterface (J1.12), MotorDriver.Mikroe (J4.5)
ENC_TWO: PicoInterface (J1.14), MotorDriver.Mikroe (J4.6)
PWM_OUT_ONE: PicoInterface (J1.4), MotorDriver.Mikroe (M1.16)
PWM_OUT_TWO: PicoInterface (J1.5), MotorDriver.Mikroe (M1.15)